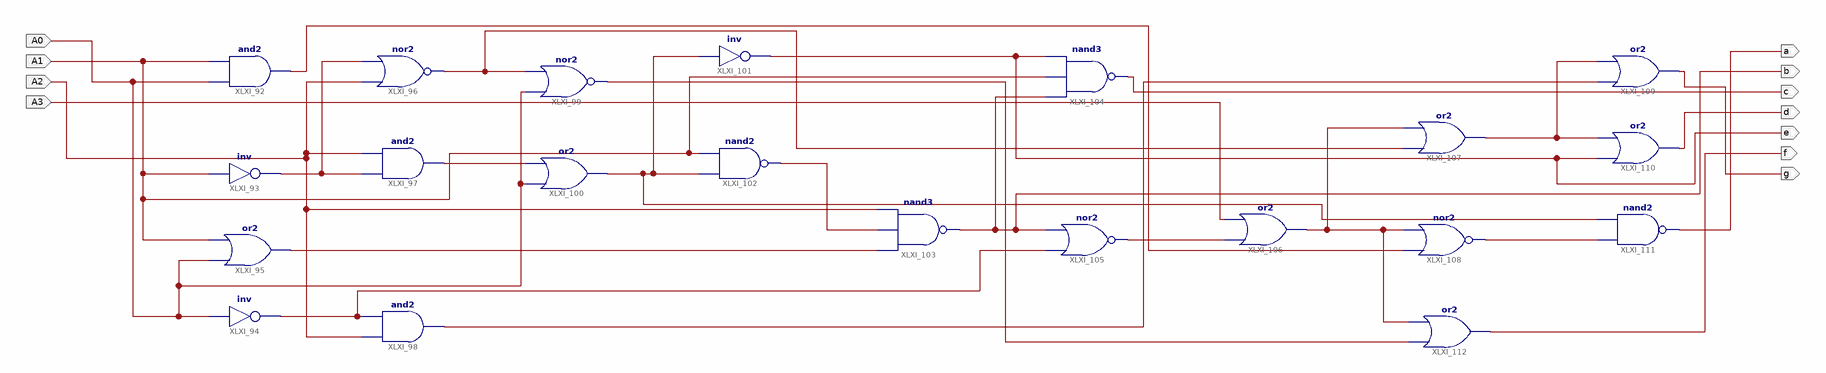
[diagram p0: schematic sheet 1]
// Xilinx ISE schematic ssd1d09.sch (spartan6) as structural Verilog: 21 symbols, 11 ports
module ssd1d09 (
  input  A2,
  input  A0,
  input  A1,
  input  A3,
  output f,
  output a,
  output d,
  output g,
  output b,
  output c,
  output e
);

  wire XLXN_109, XLXN_111, XLXN_113, XLXN_114, XLXN_117, XLXN_118, XLXN_119, XLXN_125, XLXN_129, XLXN_130,
       XLXN_131, XLXN_132, XLXN_134, XLXN_135;

  and XLXI_92 (XLXN_129, A0, A1);
  not XLXI_93 (XLXN_109, A1);
  not XLXI_94 (XLXN_111, A0);
  or XLXI_95 (XLXN_118, A0, A1);
  nor XLXI_96 (XLXN_113, A2, XLXN_109);
  and XLXI_97 (XLXN_114, XLXN_109, A2);
  and XLXI_98 (XLXN_135, A2, XLXN_111);
  nor XLXI_99 (XLXN_131, A0, XLXN_113);
  or XLXI_100 (XLXN_117, A0, XLXN_114);
  not XLXI_101 (e, XLXN_117);
  nand XLXI_102 (XLXN_119, XLXN_117, A1);
  nand XLXI_103 (b, XLXN_118, XLXN_119, A2);
  nand XLXI_104 (c, b, A1, e);
  nor XLXI_105 (XLXN_125, XLXN_111, b);
  or XLXI_106 (XLXN_130, XLXN_125, A3);
  or XLXI_107 (XLXN_134, XLXN_113, XLXN_130);
  nor XLXI_108 (XLXN_132, XLXN_129, XLXN_130);
  or XLXI_109 (g, XLXN_135, XLXN_134);
  or XLXI_110 (d, e, XLXN_134);
  nand XLXI_111 (a, XLXN_132, XLXN_117);
  or XLXI_112 (f, XLXN_131, XLXN_130);
endmodule
